# EAGLE design OMSI_TABLE12_v1 (EAGLE 9.6.1)
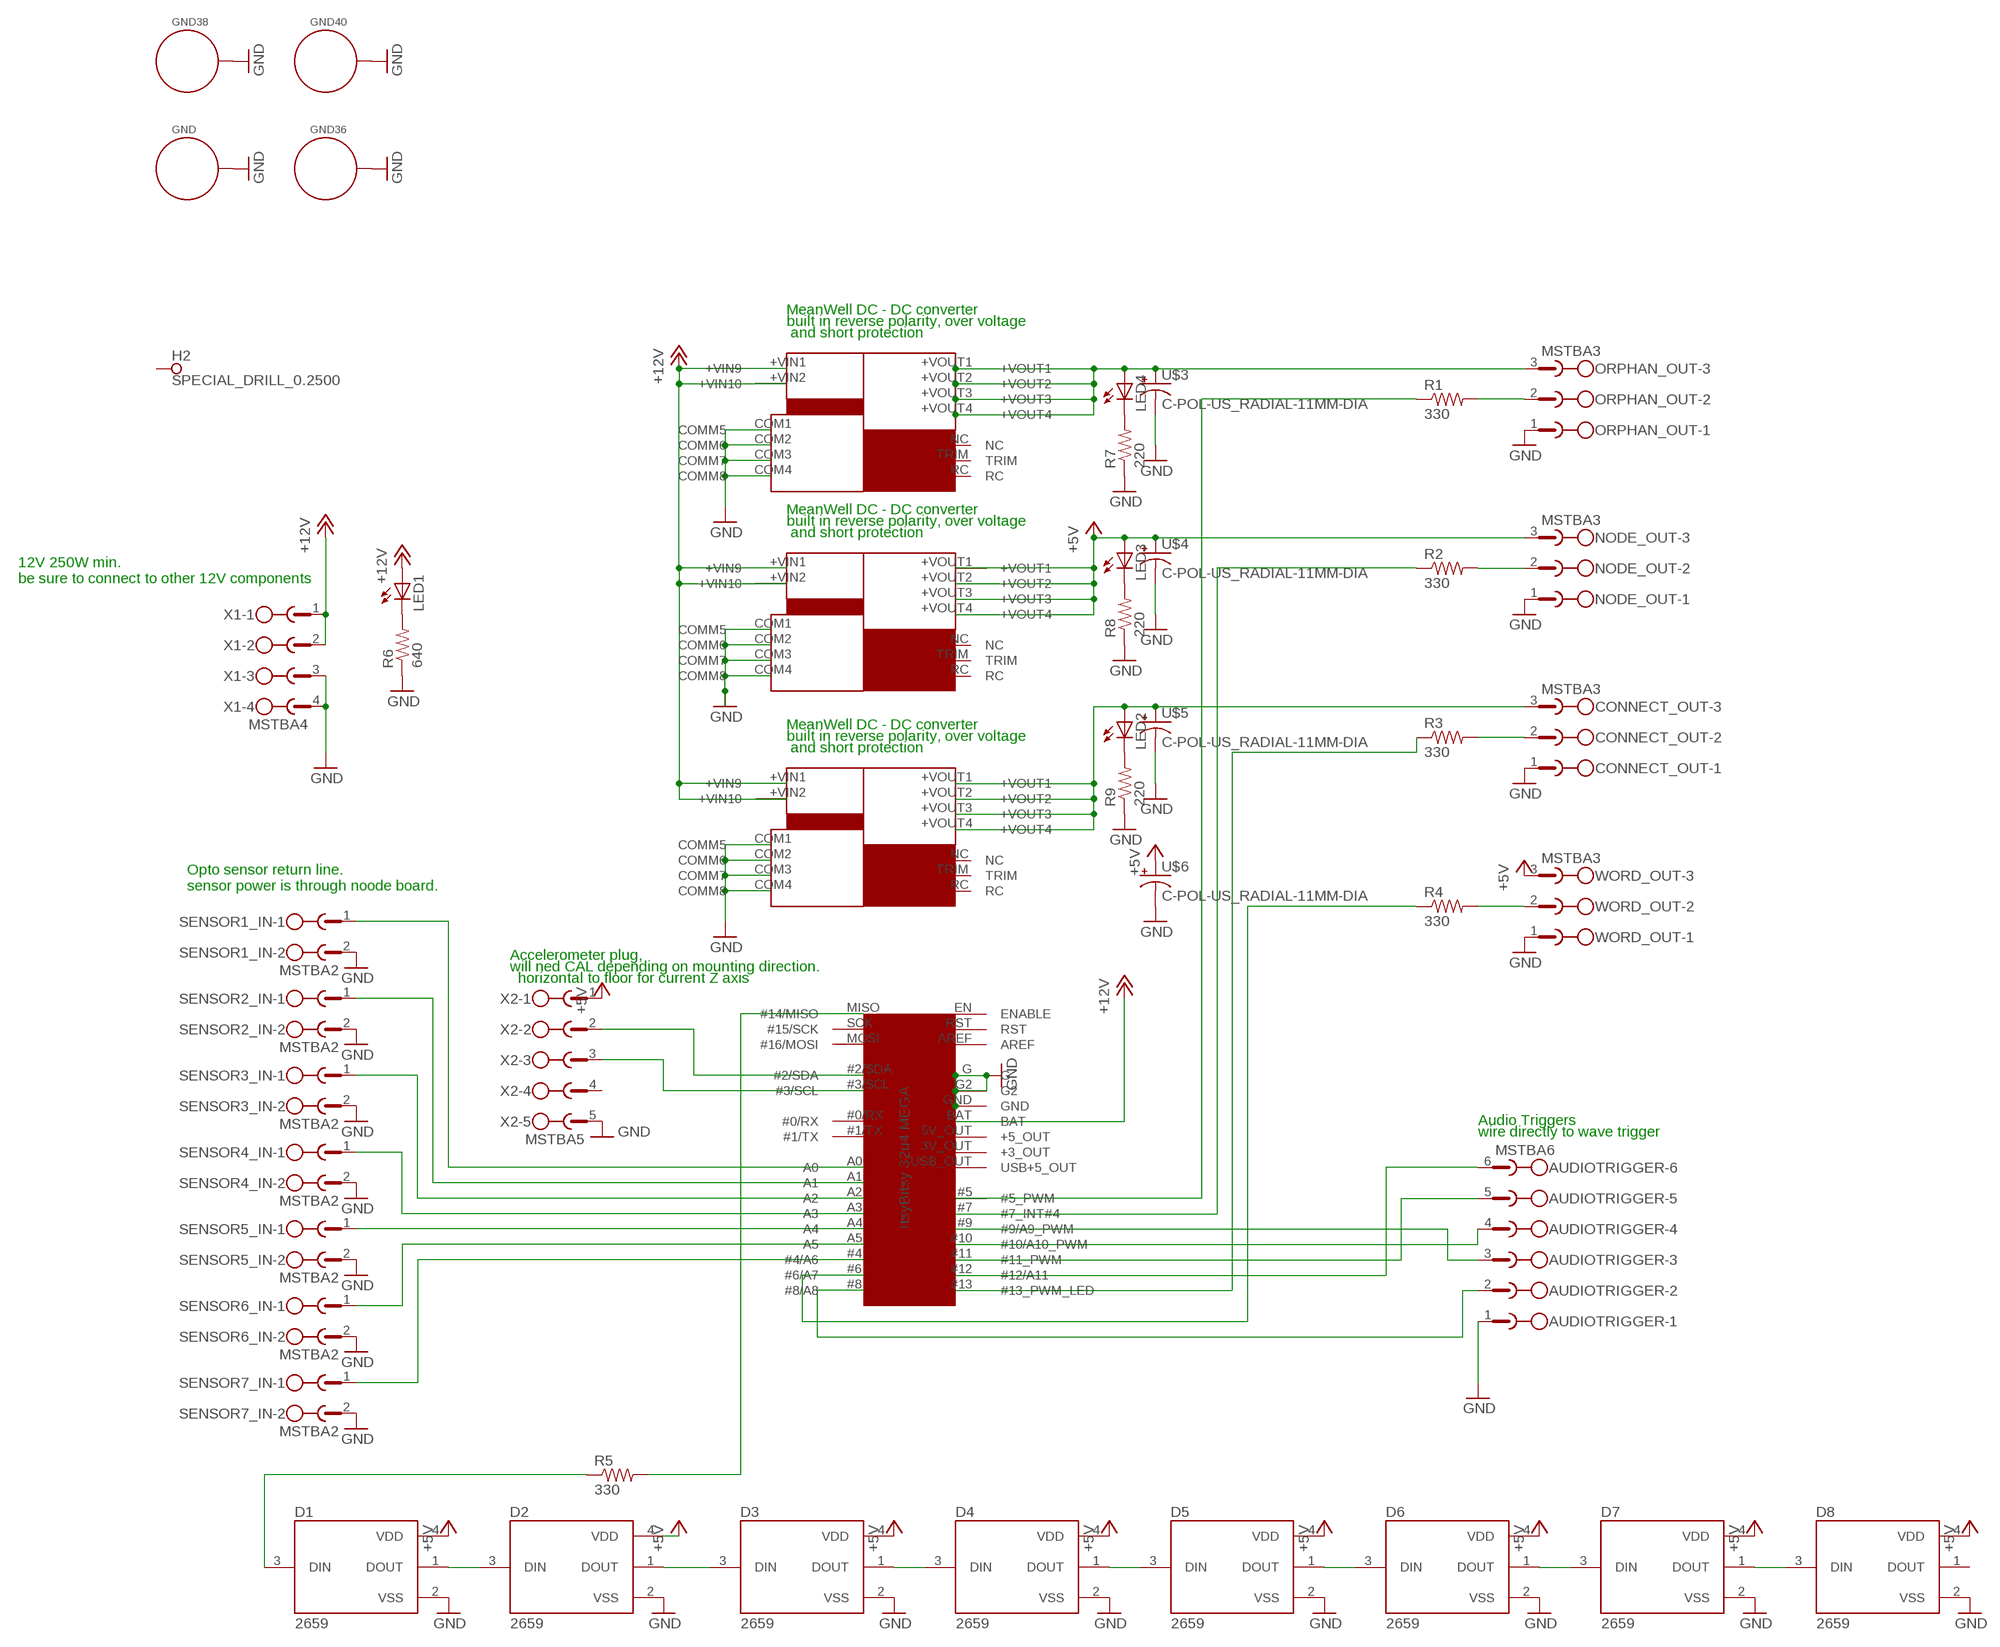
[diagram p0: schematic, sheet 1]

## Parts
AUDIOTRIGGER  MSTBA6  [MSTBA6]
CONNECT_OUT  MSTBA3  [MSTBA3]
D1  2659  [2659]
D2  2659  [2659]
D3  2659  [2659]
D4  2659  [2659]
D5  2659  [2659]
D6  2659  [2659]
D7  2659  [2659]
D8  2659  [2659]
GND  STANDOFF_ELECTRICAL5-32  [STANDOFF_ELECTRICAL_5_32]
GND36  STANDOFF_ELECTRICAL5-32  [STANDOFF_ELECTRICAL_5_32]
GND38  STANDOFF_ELECTRICAL5-32  [STANDOFF_ELECTRICAL_5_32]
GND40  STANDOFF_ELECTRICAL5-32  [STANDOFF_ELECTRICAL_5_32]
H2  SPECIAL_DRILL_0.2500  [PAD_0.2500]
LED1  LEDCHIPLED_1206  [CHIPLED_1206]
LED2  LEDCHIPLED_1206  [CHIPLED_1206]
LED3  LEDCHIPLED_1206  [CHIPLED_1206]
LED4  LEDCHIPLED_1206  [CHIPLED_1206]
MEANWELL_NID100_1  MEANWELL_NID100  [MEANWELL_NID100]
MEANWELL_NID100_2  MEANWELL_NID100  [MEANWELL_NID100]
MEANWELL_NID100_3  MEANWELL_NID100  [MEANWELL_NID100]
NODE_OUT  MSTBA3  [MSTBA3]
ORPHAN_OUT  MSTBA3  [MSTBA3]
R1  330  R-US_AXIAL-11.7MM-PITCH  [RESAD1176W63L850D250B]
R2  330  R-US_AXIAL-11.7MM-PITCH  [RESAD1176W63L850D250B]
R3  330  R-US_AXIAL-11.7MM-PITCH  [RESAD1176W63L850D250B]
R4  330  R-US_AXIAL-11.7MM-PITCH  [RESAD1176W63L850D250B]
R5  330  R-US_AXIAL-11.7MM-PITCH  [RESAD1176W63L850D250B]
R6  640  R-US_R0805  [R0805]
R7  220  R-US_R0805  [R0805]
R8  220  R-US_R0805  [R0805]
R9  220  R-US_R0805  [R0805]
SENSOR1_IN  MSTBA2  [MSTBA2]
SENSOR2_IN  MSTBA2  [MSTBA2]
SENSOR3_IN  MSTBA2  [MSTBA2]
SENSOR4_IN  MSTBA2  [MSTBA2]
SENSOR5_IN  MSTBA2  [MSTBA2]
SENSOR6_IN  MSTBA2  [MSTBA2]
SENSOR7_IN  MSTBA2  [MSTBA2]
U$1  ITSYBITSY_32U4  [ITSYBITSY_32U4]
U$3  C-POL-US_RADIAL-11MM-DIA  [CAPPRD508W65D1000H1100B]
U$4  C-POL-US_RADIAL-11MM-DIA  [CAPPRD508W65D1000H1100B]
U$5  C-POL-US_RADIAL-11MM-DIA  [CAPPRD508W65D1000H1100B]
U$6  C-POL-US_RADIAL-11MM-DIA  [CAPPRD508W65D1000H1100B]
WORD_OUT  MSTBA3  [MSTBA3]
X1  MSTBA4  [MSTBA4]
X2  MSTBA5  [MSTBA5]

## Nets
+5V: D1.4(VDD) D2.4(VDD) D3.4(VDD) D4.4(VDD) D5.4(VDD) D6.4(VDD) D7.4(VDD) D8.4(VDD) LED3.A MEANWELL_NID100_3.+VOUT1 MEANWELL_NID100_3.+VOUT2 MEANWELL_NID100_3.+VOUT3 MEANWELL_NID100_3.+VOUT4 NODE_OUT.3 U$4.1(+) U$6.1(+) WORD_OUT.3 X2.1
+12V: LED1.A MEANWELL_NID100_1.+VIN1(+VIN9) MEANWELL_NID100_1.+VIN2(+VIN10) MEANWELL_NID100_2.+VIN1(+VIN9) MEANWELL_NID100_2.+VIN2(+VIN10) MEANWELL_NID100_3.+VIN1(+VIN9) MEANWELL_NID100_3.+VIN2(+VIN10) U$1.BAT X1.1 X1.2
GND: AUDIOTRIGGER.1 CONNECT_OUT.1 D1.2(VSS) D2.2(VSS) D3.2(VSS) D4.2(VSS) D5.2(VSS) D6.2(VSS) D7.2(VSS) D8.2(VSS) GND36.P1 GND38.P1 GND40.P1 GND.P1 MEANWELL_NID100_1.COM1(COMM5) MEANWELL_NID100_1.COM2(COMM6) MEANWELL_NID100_1.COM3(COMM7) MEANWELL_NID100_1.COM4(COMM8) MEANWELL_NID100_2.COM1(COMM5) MEANWELL_NID100_2.COM2(COMM6) MEANWELL_NID100_2.COM3(COMM7) MEANWELL_NID100_2.COM4(COMM8) MEANWELL_NID100_3.COM1(COMM5) MEANWELL_NID100_3.COM2(COMM6) MEANWELL_NID100_3.COM3(COMM7) MEANWELL_NID100_3.COM4(COMM8) NODE_OUT.1 ORPHAN_OUT.1 R6.1 R7.1 R8.1 R9.1 SENSOR1_IN.2 SENSOR2_IN.2 SENSOR3_IN.2 SENSOR4_IN.2 SENSOR5_IN.2 SENSOR6_IN.2 SENSOR7_IN.2 U$1.G U$1.G2 U$1.GND U$3.2(-) U$4.2(-) U$5.2(-) U$6.2(-) WORD_OUT.1 X1.3 X1.4 X2.5
N$1: LED4.A MEANWELL_NID100_2.+VOUT1 MEANWELL_NID100_2.+VOUT2 MEANWELL_NID100_2.+VOUT3 MEANWELL_NID100_2.+VOUT4 ORPHAN_OUT.3 U$3.1(+)
N$2: U$1.#2/SDA X2.2
N$3: U$1.#3/SCL X2.3
N$4: SENSOR1_IN.1 U$1.A0
N$5: SENSOR2_IN.1 U$1.A1
N$6: SENSOR3_IN.1 U$1.A2
N$7: CONNECT_OUT.3 LED2.A MEANWELL_NID100_1.+VOUT1 MEANWELL_NID100_1.+VOUT2 MEANWELL_NID100_1.+VOUT3 MEANWELL_NID100_1.+VOUT4 U$5.1(+)
N$8: SENSOR4_IN.1 U$1.A3
N$9: ORPHAN_OUT.2 R1.2
N$10: R1.1 U$1.#5(#5_PWM)
N$11: NODE_OUT.2 R2.2
N$12: SENSOR5_IN.1 U$1.A4
N$13: SENSOR6_IN.1 U$1.A5
N$14: SENSOR7_IN.1 U$1.#4(#4/A6)
N$15: R2.1 U$1.#7(#7_INT#4)
N$16: CONNECT_OUT.2 R3.2
N$17: R3.1 U$1.#13(#13_PWM_LED)
N$18: R4.2 WORD_OUT.2
N$19: R4.1 U$1.#6(#6/A7)
N$20: AUDIOTRIGGER.6 U$1.#12(#12/A11)
N$21: AUDIOTRIGGER.5 U$1.#11(#11_PWM)
N$22: R5.2 U$1.MISO(#14/MISO)
N$23: AUDIOTRIGGER.4 U$1.#10(#10/A10_PWM)
N$24: AUDIOTRIGGER.3 U$1.#9(#9/A9_PWM)
N$25: AUDIOTRIGGER.2 U$1.#8(#8/A8)
N$26: D1.1(DOUT) D2.3(DIN)
N$27: D2.1(DOUT) D3.3(DIN)
N$28: D3.1(DOUT) D4.3(DIN)
N$29: D4.1(DOUT) D5.3(DIN)
N$30: D5.1(DOUT) D6.3(DIN)
N$31: D6.1(DOUT) D7.3(DIN)
N$32: D7.1(DOUT) D8.3(DIN)
N$33: D1.3(DIN) R5.1
N$34: LED1.C R6.2
N$35: LED4.C R7.2
N$36: LED3.C R8.2
N$37: LED2.C R9.2
Unconnected: D8.1(DOUT) H2.1 MEANWELL_NID100_1.NC MEANWELL_NID100_1.RC MEANWELL_NID100_1.TRIM MEANWELL_NID100_2.NC MEANWELL_NID100_2.RC MEANWELL_NID100_2.TRIM MEANWELL_NID100_3.NC MEANWELL_NID100_3.RC MEANWELL_NID100_3.TRIM U$1.#0/RX U$1.#1/TX U$1.EN(ENABLE) U$1.MOSI(#16/MOSI) U$1.SCK(#15/SCK) X2.4

## Notes on the sheet
- MeanWell DC - DC converter
  built in reverse polarity, over voltage
   and short protection
- MeanWell DC - DC converter
  built in reverse polarity, over voltage
   and short protection
- 12V 250W min.
  be sure to connect to other 12V components
- MeanWell DC - DC converter
  built in reverse polarity, over voltage
   and short protection
- Opto sensor return line.
  sensor power is through noode board.
- Accelerometer plug, 
  will ned CAL depending on mounting direction.
    horizontal to floor for current Z axis
- Audio Triggers
  wire directly to wave trigger

## Power pins joined to a net without a drawn wire
+3_OUT: U$1.3V_OUT(+3_OUT)
+5_OUT: U$1.5V_OUT(+5_OUT)
AREF: U$1.AREF
RST: U$1.RST
USB+5_OUT: U$1.USB_OUT(USB+5_OUT)

## Library data of the parts
AUDIOTRIGGER = con-phoenix-508:MSTBA6: PHOENIX; MF: FARNELL; MPN: 1757284; OC_FARNELL: 3705213; OC_NEWARK: 71C4165
CONNECT_OUT NODE_OUT ORPHAN_OUT WORD_OUT = con-phoenix-508:MSTBA3: PHOENIX; MF: FARNELL; MPN: 1757255; OC_FARNELL: 3705183; OC_NEWARK: 71C4162
D1-D8 = 2659:2659: NeoPixel Mini 3535 RGB LEDs w/ Integrated Driver Chip - White; DESCRIPTION: 20 AWG Hook-Up Wire 26/34 White 300V 40.00' _12.19m_; MF: Adafruit Industries; MP: 2659; PACKAGE: TQFP-32 Adafruit Industries
GND GND36 GND38 GND40 = th_libraries:STANDOFF_ELECTRICAL: A standoff intended to be an electrically connected point. Pad size and stop size allow for a #8 Phillips pan screw head to make a solid connection to the board. Added 144mill drill hole that fits my normal wood screw
H2 = special-drill:SPECIAL_DRILL_: Special drills
LED1-LED4 = adafruit:LED: LED OSRAM: - CHIPLED LG R971, LG N971, LY N971, LG Q971, LY Q971, LO R971, LY R971 LH N974, LH R974 LS Q976, LO Q976, LY Q976 LO Q996 - Hyper CHIPLED LW Q18S LB Q993, LB Q99A, LB R99A - SideLED LS A670, LO A670, LY A670, LG A670, LP A670 LB A673, LV A673, LT A673, LW A673 LH A674 LY A675 LS A676, LA A676, LO A676, LY A676, LW A676 LS A679, LY A679, LG A679 - Hyper Micro SIDELED® LS Y876, LA Y876, LO Y876, LY Y876 LT Y87S - SmartLED LW L88C, LW L88S LB L89C, LB L89S, LG L890 LS L89K, LO L89K, LY L89K LS L896, LA L896, LO L896, LY L896 - TOPLED LS T670, LO T670, LY T670, LG T670, LP T670 LSG T670, LSP T670, LSY T670, LOP T670, LYG T670 LG T671, LOG T671, LSG T671 LB T673, LV T673, LT T673, LW T673 LH T674 LS T676, LA T676, LO T676, LY T676, LB T676, LH T676, LSB T676, LW T676 LB T67C, LV T67C, LT T67C, LS T67K, LO T67K, LY T67K, LW E67C LS E67B, LA E67B, LO E67B, LY E67B, LB E67C, LV E67C, LT E67C LW T67C LS T679, LY T679, LG T679 LS T770, LO T770, LY T770, LG T770, LP T770 LB T773, LV T773, LT T773, LW T773 LH T774 LS E675, LA E675, LY E675, LS T675 LS T776, LA T776, LO T776, LY T776, LB T776 LHGB T686 LT T68C, LB T68C - Hyper Mini TOPLED® LB M676 - Mini TOPLED Santana® LG M470 LS M47K, LO M47K, LY M47K Source: http://www.osram.convergy.de/
MEANWELL_NID100_1-MEANWELL_NID100_3 = _Library_test.fef566de-641b-440a-8c62-be1921989066.flbr:MEANWELL_NID100
R1-R5 = Resistor:R-US: Resistor Fixed - ANSI; CATEGORY: Resistor; SUB-CATEGORY: Fixed
R6-R9 = adafruit:R-US_: RESISTOR, American symbol
SENSOR1_IN SENSOR2_IN SENSOR3_IN SENSOR4_IN SENSOR5_IN SENSOR6_IN SENSOR7_IN = con-phoenix-508:MSTBA2: PHOENIX; MF: FARNELL; MPN: 1757242; OC_FARNELL: 3705171; OC_NEWARK: 71C4161
U$1 = _Library_test.fef566de-641b-440a-8c62-be1921989066.flbr:ITSYBITSY_32U4
U$3-U$6 = Capacitor:C-POL-US: Capacitor Polarised - ANSI; CATEGORY: Capacitor
X1 = con-phoenix-508:MSTBA4: PHOENIX; MF: FARNELL; MPN: 1757268; OC_FARNELL: 3705195; OC_NEWARK: 71C4163
X2 = con-phoenix-508:MSTBA5: PHOENIX; MPN: 1757271; OC_FARNELL: 3705201; OC_NEWARK: 71C4164

## Board
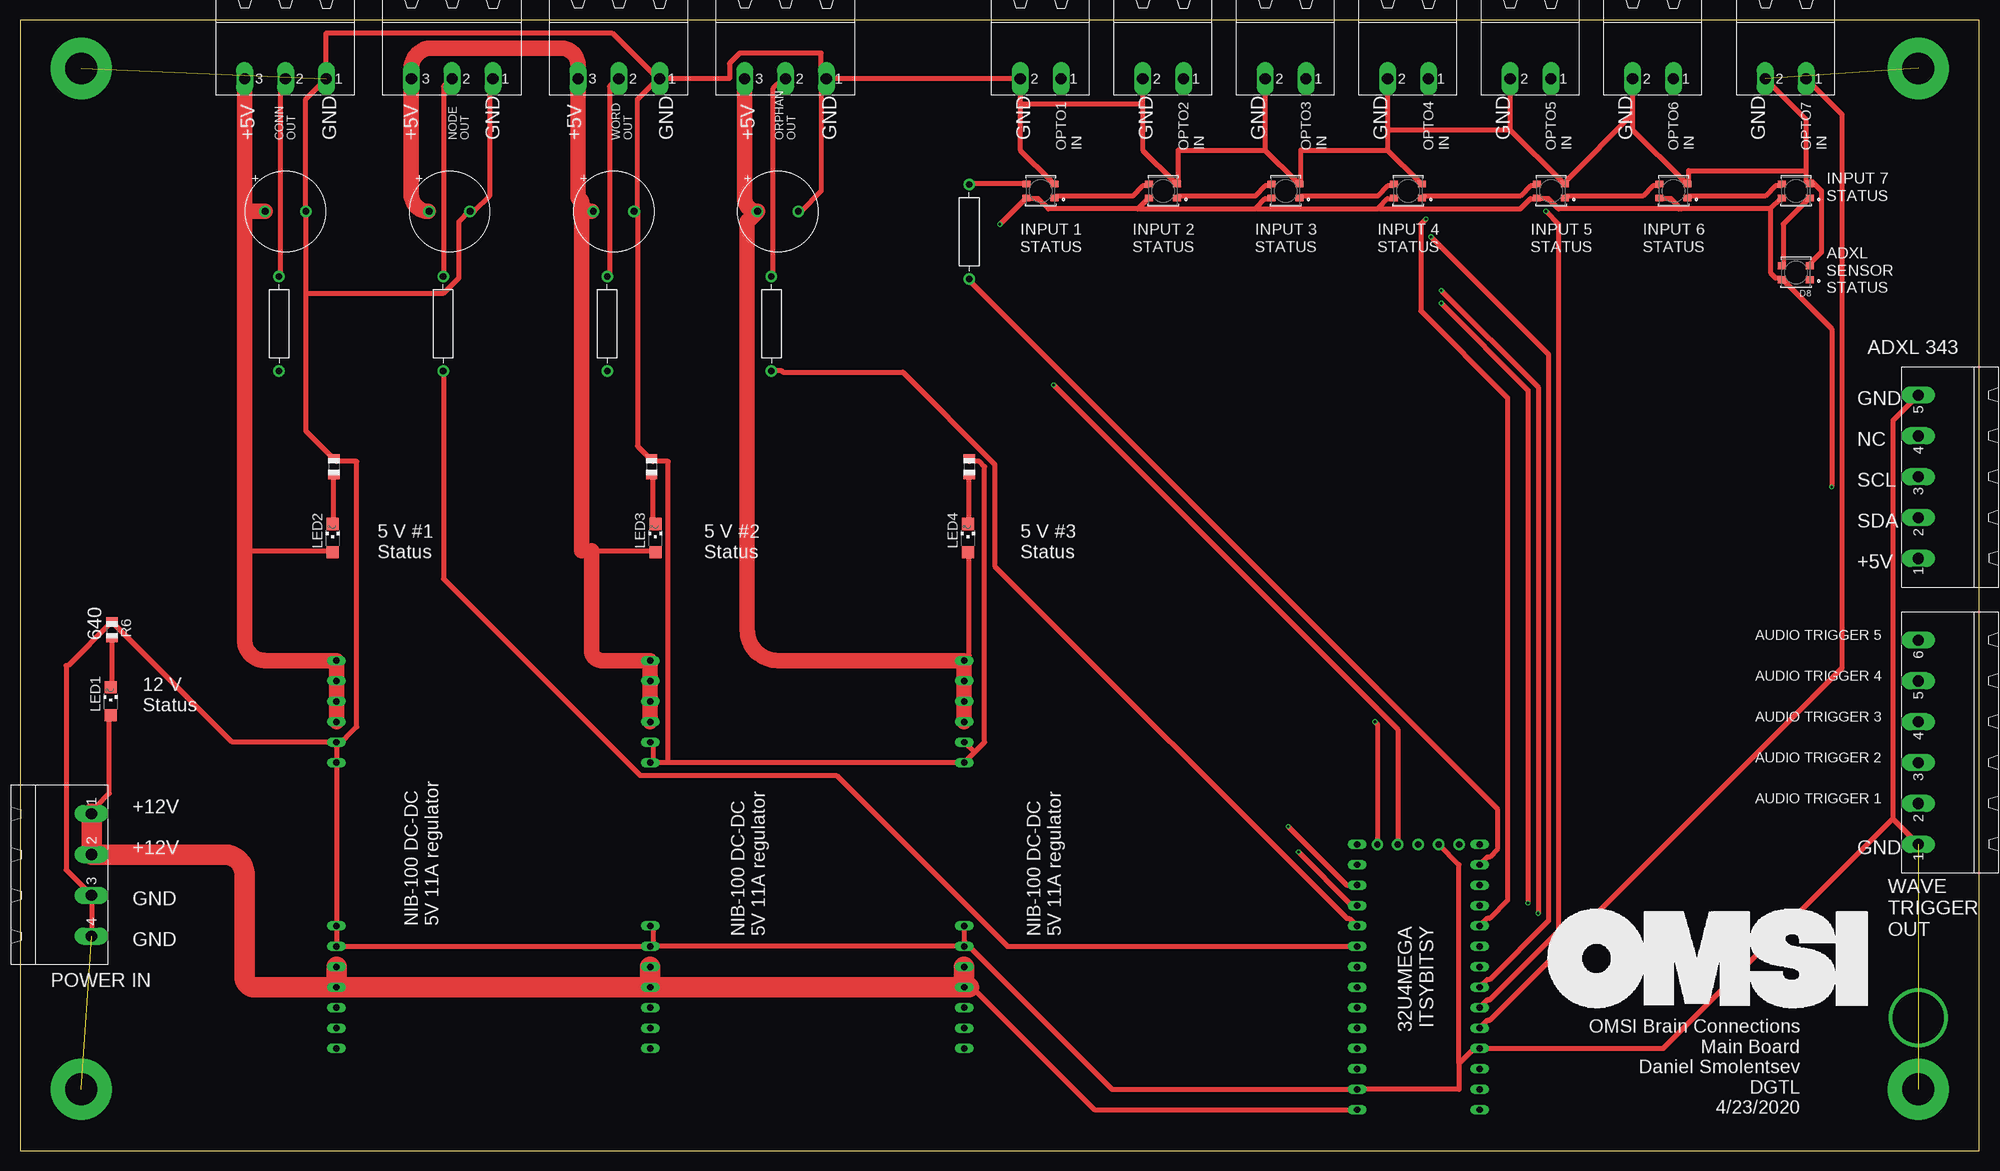
[diagram p1: board, top side]
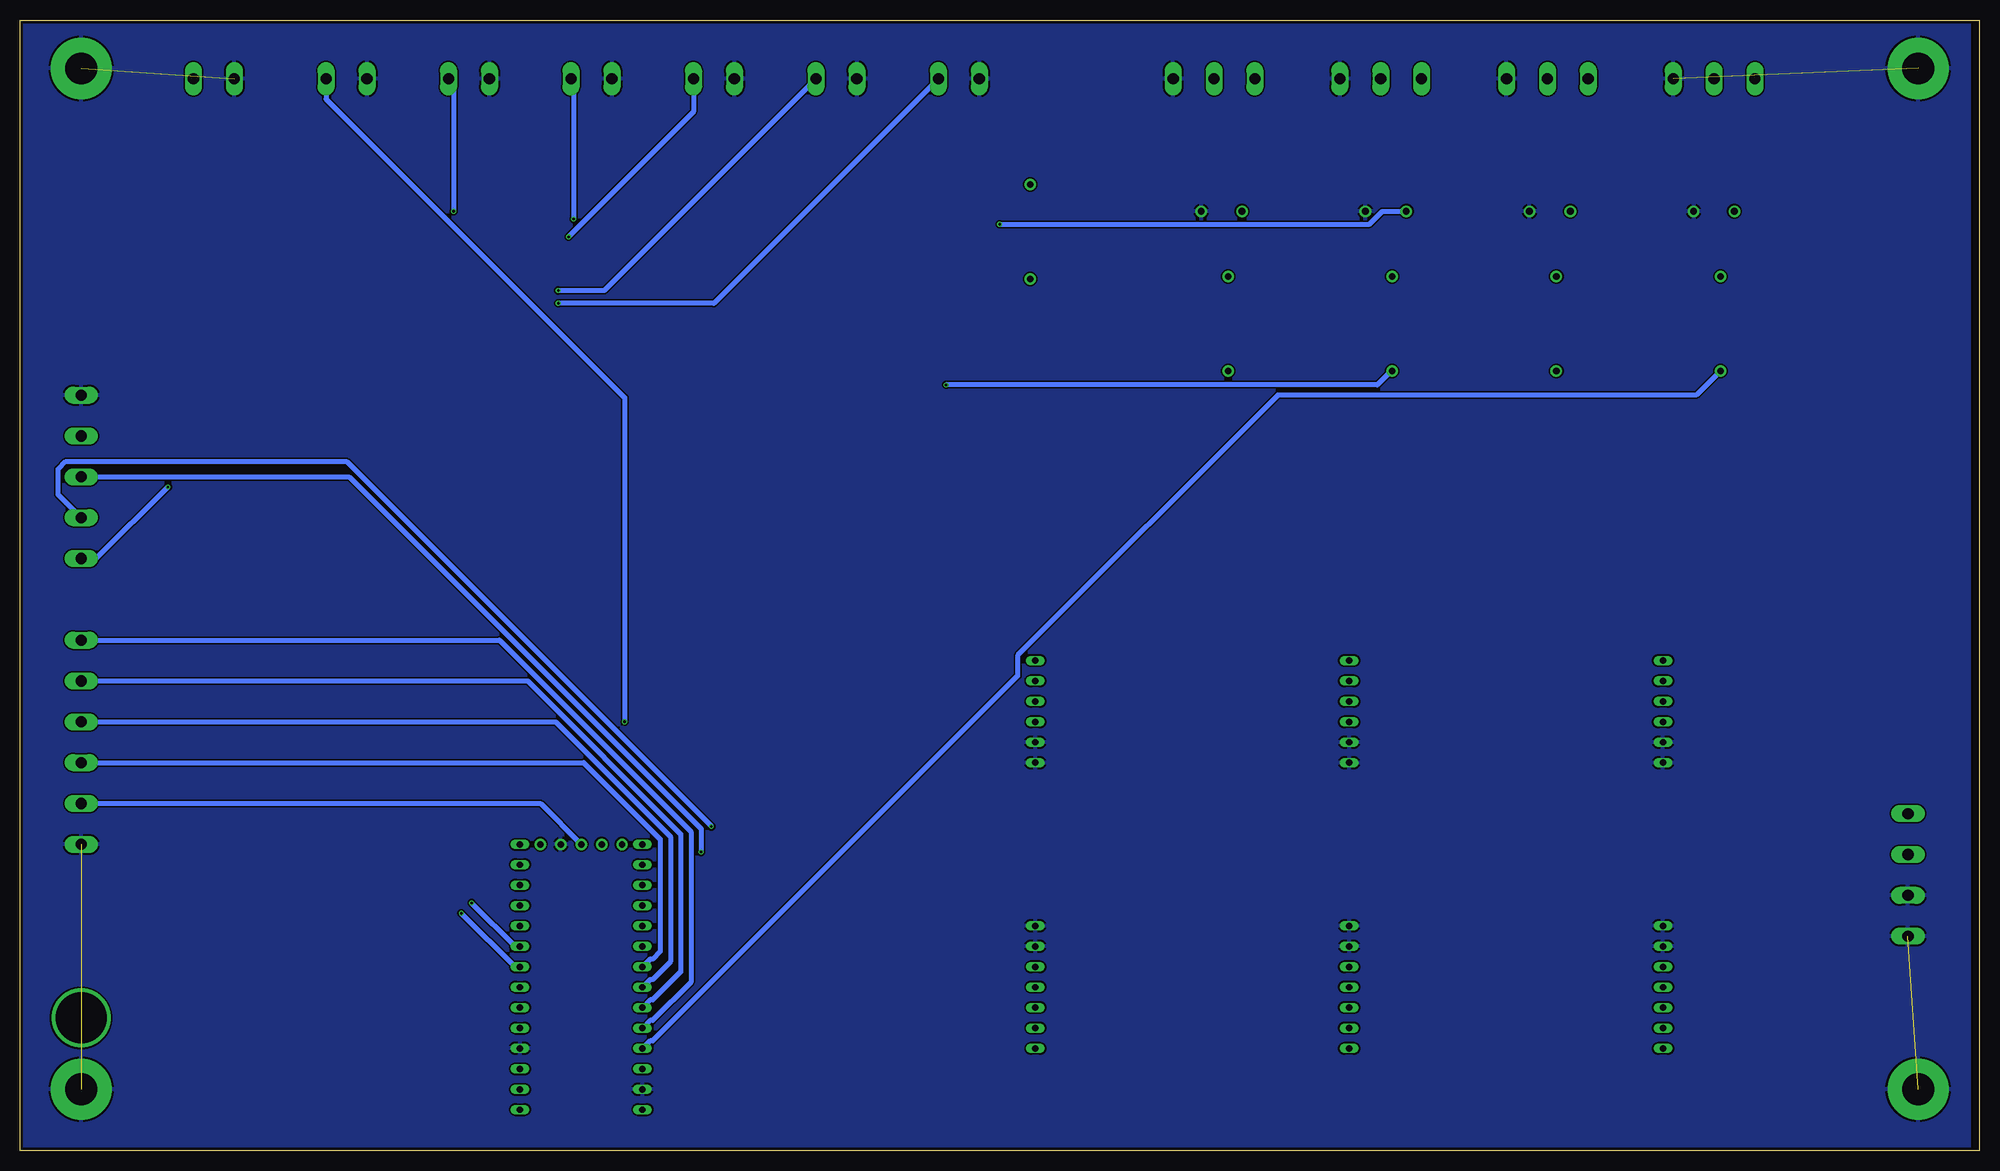
[diagram p2: board, bottom side, seen from below]

Size 243.82 x 140.64 mm. Coordinates in mm from the lower left corner, seen from the top.
Outline: 0,0 243.82,0 243.82,140.64 0,140.64 0,0
Copper layers (1*16): Top 0.035559375mm / dielectric 1.6mm / Bottom 0.035559375mm
Design rules "oshpark-2layer_8mil": minimum track width 8mil, minimum drill 10mil, track to track 8mil, track to pad 8mil, pad to pad 8mil, via to via 8mil, smd to smd 8mil, copper to edge 15mil, drill to drill 8mil, minimum pad ring 5mil, minimum via ring 5mil, stop-mask expansion 2.5mil, vias tented up to drill 0mil, thermal gap 10mil

### Footprints (pad centres in the part's own frame; a part is rotated, then mirrored left to right if it is on the bottom)
MSTBA6 = drill 1.397 long: 1 -12.7,5.08; 2 -7.62,5.08; 3 -2.54,5.08; 4 2.54,5.08; 5 7.62,5.08; 6 12.7,5.08
MSTBA3 = drill 1.397 long: 1 -5.08,5.08; 2 0,5.08; 3 5.08,5.08
2659 = smd 1 x 0.85: 1 -1.75,0.875; 2 -1.75,-0.875; 3 1.75,-0.875; 4 1.75,0.875
STANDOFF_ELECTRICAL_5_32 = drill 3.969 pad 7.62: P1 0,0
PAD_0.2500 = drill 6.35 pad 6.35: 1 0,0
CHIPLED_1206 = smd 1.5 x 1.5: A 0,-1.75; C 0,1.75
MEANWELL_NID100 = drill 0.8 long: +VIN1 0,-20.32; +VIN2 0,-22.86; +VOUT1 0,17.78; +VOUT2 0,15.24; +VOUT3 0,12.7; +VOUT4 0,10.16; COM1 0,7.62; COM2 0,5.08; COM3 0,-15.24; COM4 0,-17.78; NC 0,-25.4; RC 0,-30.48; TRIM 0,-27.94
RESAD1176W63L850D250B = drill 0.83 pad 1.43: 1 -5.88,0; 2 5.88,0
R0805 = smd 1.1 x 1.4: 1 -1,0; 2 1,0
MSTBA2 = drill 1.397 long: 1 -2.54,5.08; 2 2.54,5.08
ITSYBITSY_32U4 = drill 0.8 long: 3V_OUT -7.62,-17.78; 5V_OUT -7.62,12.7; #0/RX 7.62,-17.78; #1/TX 7.62,-15.24; #2/SDA 7.62,-12.7; #3/SCL 7.62,-10.16; #5 7.62,-7.62; #7 7.62,-5.08; #9 7.62,-2.54; #10 7.62,0; #11 7.62,2.54; #12 7.62,5.08; #13 7.62,7.62; A0 -7.62,5.08; A1 -7.62,2.54; A2 -7.62,0; A3 -7.62,-2.54; A4 -7.62,-5.08; A5 -7.62,-7.62; AREF -7.62,10.16; BAT 7.62,15.24; G2 7.62,12.7; GND -7.62,7.62; MISO -7.62,-15.24; MOSI -7.62,-12.7; RST -7.62,15.24; SCK -7.62,-10.16; USB_OUT 7.62,10.16 | drill 0.8 pad 1.422: #4 5.08,-17.78; #6 2.54,-17.78; #8 0,-17.78; EN -5.08,-17.78; G -2.54,-17.78
CAPPRD508W65D1000H1100B = drill 0.85 pad 1.45: 1 -2.54,0; 2 2.54,0
MSTBA4 = drill 1.397 long: 1 -7.62,5.08; 2 -2.54,5.08; 3 2.54,5.08; 4 7.62,5.08
MSTBA5 = drill 1.397 long: 1 -10.16,5.08; 2 -5.08,5.08; 3 0,5.08; 4 5.08,5.08; 5 10.16,5.08

### Placement (x,y rotation side)
AUDIOTRIGGER  241.3,50.8 90 top
CONNECT_OUT  33.02,138.43 180 top
D1  127,119.38 180 top
D2  142.24,119.38 180 top
D3  157.48,119.38 180 top
D4  172.72,119.38 180 top
D5  190.5,119.38 180 top
D6  205.74,119.38 180 top
D7  220.98,119.38 180 top
D8  220.98,109.22 180 top
GND  7.62,7.62 0 top
GND36  236.22,7.62 0 top
GND38  7.62,134.62 0 top
GND40  236.22,134.62 0 top
H2  236.22,16.51 0 top
LED1  11.27,55.88 0 top
LED2  38.89,76.2 0 top
LED3  79.06,76.2 0 top
LED4  117.95,76.2 0 top
MEANWELL_NID100_1  39.37,43.18 0 top
MEANWELL_NID100_2  117.48,43.18 0 top
MEANWELL_NID100_3  78.42,43.18 0 top
NODE_OUT  53.76,138.43 180 top
ORPHAN_OUT  95.25,138.43 180 top
R1  93.5,102.87 90 top
R2  52.65,102.87 90 top
R3  32.23,102.87 90 top
R4  73.07,102.87 90 top
R5  118.11,114.3 270 top
R6  11.43,64.77 270 top
R7  118.11,85.09 270 top
R8  78.58,85.09 270 top
R9  39.05,85.09 270 top
SENSOR1_IN  219.71,138.43 180 top
SENSOR2_IN  187.96,138.43 180 top
SENSOR3_IN  157.48,138.43 180 top
SENSOR4_IN  142.24,138.43 180 top
SENSOR5_IN  127,138.43 180 top
SENSOR6_IN  172.72,138.43 180 top
SENSOR7_IN  203.2,138.43 180 top
U$1  173.99,20.32 180 top
U$3  94.29,116.84 0 top
U$4  73.87,116.84 0 top
U$5  33.02,116.84 0 top
U$6  53.44,116.84 0 top
WORD_OUT  74.51,138.43 180 top
X1  3.81,34.29 270 top
X2  241.3,83.82 90 top

### Tracks (layer width: path | path; a pad name or v marks a point on that pad's centre or on a via)
+5V  (via drill 0.35)
  Top 0.61: 69.85,74.61 71.12,74.61 78.74,74.61 LED3.A | U$6.1 50.8,116.84 | U$4.1 71.12,116.84 | 139.22,117.32 139.06,117.16 127.95,117.16 126.68,118.43 125.41,118.43 D1.4 125.09,118.43 v121.92,115.25 | 153.83,117.32 153.67,117.16 139.38,117.16 139.22,117.32 | 153.83,117.32 154.94,118.43 155.58,118.43 D3.4 | 169.07,117.32 168.91,117.16 153.99,117.16 153.83,117.32 | 169.07,117.32 170.18,118.43 170.81,118.43 D4.4 | 169.07,117.32 169.23,117.16 186.69,117.16 187.96,118.43 188.59,118.43 D5.4 188.91,118.43 190.18,118.43 191.45,117.16 206.38,117.16 206.53,117.32 | 217.81,117.16 217.81,109.22 218.44,108.58 219.08,108.58 D8.4 219.39,108.27 225.43,102.23 v225.43,82.55 | 217.81,117.16 219.08,118.43 D7.4 | 206.53,117.32 206.69,117.16 217.81,117.16 | 206.53,117.32 205.42,118.43 204.15,118.43 D6.4 | 139.22,117.32 140.41,118.5 D2.4
  Top 1.905: 50.8,116.84 arc-90 48.68,118.96 NODE_OUT.3 48.68,134.62 arc-90 51.22,137.16 67.31,137.16 arc-90 69.43,135.04 WORD_OUT.3 69.43,118.53 69.85,118.11 | 69.85,118.11 arc90 71.12,116.84 | 69.85,118.11 69.85,74.61 | 71.12,74.61 71.12,62.23 arc90 72.39,60.96 MEANWELL_NID100_3.+VOUT1 MEANWELL_NID100_3.+VOUT2 MEANWELL_NID100_3.+VOUT3 MEANWELL_NID100_3.+VOUT4
  Bottom 0.61: X2.1 234.31,73.66 v225.43,82.55 | U$4.1 74.3,116.84 75.88,115.25 v121.92,115.25
+12V
  Top 0.61: LED1.A 11.11,53.98 11.11,44.45 9.53,42.86 X1.1 | U$1.BAT 133.67,5.08 119.06,19.69 118.11,20.32
  Top 2.54: X1.1 X1.2 25.4,36.83 arc-90 27.94,34.29 27.94,21.59 arc90 29.21,20.32 MEANWELL_NID100_1.+VIN2 | MEANWELL_NID100_1.+VIN1 MEANWELL_NID100_1.+VIN2 | MEANWELL_NID100_3.+VIN2 MEANWELL_NID100_1.+VIN2 | MEANWELL_NID100_2.+VIN2 118.11,20.32 | MEANWELL_NID100_2.+VIN2 MEANWELL_NID100_2.+VIN1 | MEANWELL_NID100_2.+VIN2 MEANWELL_NID100_3.+VIN2 | MEANWELL_NID100_3.+VIN1 MEANWELL_NID100_3.+VIN2
GND  (4 unrouted)
  Top 0.61: 76.84,116.84 76.84,87.63 78.11,86.36 R8.1 78.74,85.72 80.65,85.72 80.65,48.26 | 79.38,133.35 76.84,130.81 76.84,116.84 | 76.84,116.84 U$4.2 | 78.74,48.26 78.74,50.8 MEANWELL_NID100_3.COM1 | 118.75,49.53 MEANWELL_NID100_2.COM2 80.65,48.26 | 118.75,49.53 120.02,50.8 120.02,85.09 119.38,85.72 118.11,85.72 R7.1 | 118.75,49.53 MEANWELL_NID100_2.COM1 | 80.65,48.26 78.74,48.26 | 78.74,48.26 MEANWELL_NID100_3.COM2 | D8.2 222.88,110.49 224.16,111.76 224.16,119.38 222.88,120.65 D7.2 222.25,120.65 222.25,121.92 | SENSOR1_IN.2 222.25,128.27 222.25,121.92 | 185.42,127 191.77,120.65 D5.2 192.41,120.65 200.66,128.91 | SENSOR2_IN.2 185.42,127 | SENSOR7_IN.2 200.66,128.91 | 200.66,128.91 200.66,127 207.01,120.65 D6.2 207.65,120.65 207.65,121.92 222.25,121.92 | 99.7,133.35 99.7,119.38 97.16,116.84 U$3.2 | 170.18,124.46 173.99,120.65 D4.2 | SENSOR6_IN.2 170.18,127 | 170.18,127 170.18,124.46 | 154.94,124.46 158.75,120.65 D3.2 159.38,120.65 159.38,124.46 170.18,124.46 | SENSOR3_IN.2 154.94,124.46 | 124.46,130.18 SENSOR5_IN.2 ORPHAN_OUT.1 99.7,133.35 | 124.46,130.18 124.46,124.46 128.27,120.65 D1.2 | SENSOR4_IN.2 139.7,130.18 | 139.7,130.18 139.7,124.46 143.51,120.65 D2.2 144.15,120.65 144.15,124.46 154.94,124.46 | 139.7,130.18 124.46,130.18 | 170.18,127 185.42,127 | 99.7,133.35 99.7,136.53 89.54,136.53 88.27,135.25 88.27,133.35 WORD_OUT.1 79.38,133.35 | NODE_OUT.1 58.42,133.35 58.42,118.74 56.52,116.84 U$6.2 55.88,116.84 54.61,115.57 54.61,108.58 52.7,106.68 35.56,106.68 | 35.56,106.68 U$5.2 35.56,130.81 CONNECT_OUT.1 38.1,139.06 73.66,139.06 79.38,133.35 | 35.56,106.68 35.56,89.53 38.73,86.36 R9.1 39.37,85.72 41.91,85.72 41.91,52.7 39.37,50.16
  Top 0.61: 233.05,41.27 AUDIOTRIGGER.1 | 233.05,41.27 233.05,90.8 X2.5 | 179.07,10.8 179.07,7.62 U$1.G2 135.89,7.62 117.48,26.04 | 179.07,10.8 180.97,12.7 U$1.GND 204.47,12.7 233.05,41.27 | U$1.G 179.07,35.56 179.07,10.8 | 78.74,25.4 78.74,27.94 MEANWELL_NID100_3.COM3 | MEANWELL_NID100_2.COM3 117.48,26.04 | 78.74,25.4 MEANWELL_NID100_2.COM4 117.48,26.04 | 78.74,25.4 MEANWELL_NID100_3.COM4 MEANWELL_NID100_1.COM4 MEANWELL_NID100_1.COM3 MEANWELL_NID100_1.COM2 39.37,50.16 | X1.4 X1.3 5.71,34.93 5.71,60.33 5.99,60.33 R6.1 26.4,50.8 MEANWELL_NID100_1.COM1 39.37,50.16
  pour Bottom: 1.27,0 1.27,140.97 243.84,140.97 243.84,0
N$1
  Top 0.61: LED4.A 118.11,74.29 118.11,61.6 MEANWELL_NID100_2.+VOUT1
  Top 1.905: ORPHAN_OUT.3 90.17,118.42 arc90 U$3.1 90.48,115.57 90.48,64.77 arc90 94.29,60.96 MEANWELL_NID100_2.+VOUT1 MEANWELL_NID100_2.+VOUT2 MEANWELL_NID100_2.+VOUT3 MEANWELL_NID100_2.+VOUT4
N$2  (via drill 0.35)
  Top 0.61: U$1.#2/SDA 165.1,33.02 v157.8,40.32
  Bottom 0.61: v157.8,40.32 203.2,85.72 238.12,85.72 239.08,84.77 239.08,81.6 X2.2
N$3  (via drill 0.35)
  Top 0.61: U$1.#3/SCL 165.74,30.48 v159.07,37.15
  Bottom 0.61: v159.07,37.15 159.07,40.01 202.88,83.82 X2.3
N$4
  Top 0.61: U$1.A0 182.56,16.19 182.88,16.19 226.69,60.01 226.69,128.91 SENSOR1_IN.1
N$5  (via drill 0.35)
  Top 0.61: U$1.A1 182.56,18.73 182.88,18.73 191.45,27.3 191.45,115.25 v189.87,116.84
  Bottom 0.61: v189.87,116.84 189.87,132.72 SENSOR2_IN.1
N$6  (via drill 0.35)
  Top 0.61: U$1.A2 182.56,21.27 182.88,21.27 190.18,28.57 190.18,99.06 v175.58,113.66
  Bottom 0.61: v175.58,113.66 160.02,129.22 SENSOR3_IN.1
N$7
  Top 0.61: 27.94,74.61 38.73,74.61 LED2.A
  Top 1.905: CONNECT_OUT.3 27.94,116.84 | 27.94,116.84 U$5.1 | 27.94,116.84 27.94,74.61 27.94,63.5 arc90 30.48,60.96 MEANWELL_NID100_1.+VOUT1 MEANWELL_NID100_1.+VOUT2 MEANWELL_NID100_1.+VOUT3 MEANWELL_NID100_1.+VOUT4
N$8  (via drill 0.35)
  Top 0.61: v188.91,29.53 188.91,94.93 v176.85,107
  Bottom 0.61: U$1.A3 182.25,22.86 v188.91,29.53 | v176.85,107 171.13,107 SENSOR4_IN.1
N$9
  Top 0.61: R1.2 93.66,108.9 93.66,132.08 94.93,133.35 ORPHAN_OUT.2
N$10
  Top 0.61: U$1.#5 165.42,28.89 165.1,28.89 121.29,72.71 121.29,85.41 109.86,96.84 94.93,96.84 94.77,96.99 R1.1
N$11
  Top 0.61: R2.2 52.7,108.9 52.7,132.4 53.66,133.35 NODE_OUT.2
N$12  (via drill 0.35)
  Top 0.61: v187.64,30.8 187.64,94.61 v176.85,105.41
  Bottom 0.61: U$1.A4 182.25,25.4 v187.64,30.8 | v176.85,105.41 157.48,105.41 SENSOR5_IN.1
N$13  (via drill 0.35)
  Top 0.61: U$1.A5 182.56,28.89 182.88,28.89 185.1,31.12 185.1,93.66 174.31,104.46 174.31,115.25 v174.94,115.89
  Bottom 0.61: v174.94,115.89 174.94,133.03 SENSOR6_IN.1
N$14  (via drill 0.35)
  Top 0.61: U$1.#4 168.91,53.02 v168.59,53.34
  Bottom 0.61: v168.59,53.34 168.59,93.66 205.74,130.81 SENSOR7_IN.1
N$15
  Top 0.61: U$1.#7 122.87,25.4 101.6,46.67 77.15,46.67 52.7,71.12 52.7,96.84 R2.1
N$16
  Top 0.61: CONNECT_OUT.2 32.38,132.72 32.38,108.9 R3.2
N$17
  Bottom 0.61: U$1.#13 165.42,13.65 165.1,13.65 119.7,59.05 119.7,61.6 87.31,93.98 35.24,93.98 32.38,96.84 R3.1
N$18
  Top 0.61: R4.2 73.34,108.9 73.34,132.4 74.3,133.35 WORD_OUT.2
N$19  (via drill 0.35)
  Top 0.61: U$1.#6 171.45,52.39 v128.59,95.25
  Bottom 0.61: v128.59,95.25 74.93,95.25 73.34,96.84 R4.1
N$20
  Bottom 0.61: U$1.#12 165.42,16.19 165.1,16.19 160.34,20.96 160.34,39.69 184.15,63.5 AUDIOTRIGGER.6
N$21
  Bottom 0.61: U$1.#11 165.42,18.73 165.1,18.73 161.61,22.23 161.61,39.37 180.66,58.42 AUDIOTRIGGER.5
N$22
  Top 0.61: U$1.MISO 182.56,36.51 182.88,36.51 183.83,37.47 183.83,42.55 118.11,108.27 R5.2
N$23
  Bottom 0.61: U$1.#10 165.42,21.27 165.1,21.27 162.88,23.5 162.88,39.05 177.16,53.34 AUDIOTRIGGER.4
N$24
  Bottom 0.61: U$1.#9 165.42,23.81 165.1,23.81 164.15,24.77 164.15,38.73 173.67,48.26 AUDIOTRIGGER.3
N$25
  Bottom 0.61: U$1.#8 179.07,43.18 AUDIOTRIGGER.2
N$26
  Top 0.61: D1.1 128.91,118.74 138.43,118.74 139.7,120.02 140.34,120.02 D2.3
N$27
  Top 0.61: D2.1 144.15,118.74 153.67,118.74 154.94,120.02 155.58,120.02 D3.3
N$28
  Top 0.61: D3.1 159.38,118.74 168.91,118.74 170.18,120.02 170.81,120.02 D4.3
N$29
  Top 0.61: D4.1 174.62,118.74 186.69,118.74 187.96,120.02 188.59,120.02 D5.3
N$30
  Top 0.61: D5.1 192.41,118.74 201.93,118.74 203.2,120.02 203.84,120.02 D6.3
N$31
  Top 0.61: D6.1 207.65,118.74 217.17,118.74 218.44,120.02 219.08,120.02 D7.3
N$32
  Top 0.61: D8.3 219.39,110.17 219.39,115.25 222.57,118.43 D7.1
N$33
  Top 0.61: D1.3 125.09,120.33 118.11,120.33 R5.1
N$34
  Top 0.61: R6.2 11.43,57.79 LED1.C
N$35
  Top 0.61: R7.2 118.11,83.82 118.11,78.1 LED4.C
N$36
  Top 0.61: R8.2 78.74,83.82 78.74,78.1 LED3.C
N$37
  Top 0.61: R9.2 39.05,83.82 39.05,78.1 LED2.C

### Text on the board
tPlace: OMSI Brain Connections / Main Board / Daniel Smolentsev / DGTL / 4/23/2020
tNames: +5V | CONN / OUT | GND | +5V | NODE / OUT | GND | +5V | WORD / OUT | GND | +5V | ORPHAN / OUT | GND | GND | GND | GND | GND | GND | GND | GND | OPTO1 / IN | OPTO2 / IN | OPTO3 / IN | OPTO4 / IN | OPTO5 / IN | OPTO6 / IN | OPTO7 / IN | INPUT 7 / STATUS | INPUT 1 / STATUS | INPUT 2 / STATUS | INPUT 3 / STATUS | INPUT 4 / STATUS | INPUT 5 / STATUS | INPUT 6 / STATUS | ADXL / SENSOR / STATUS | ADXL 343 | GND | NC | SCL | SDA | 5 V #1 / Status | 5 V #2 / Status | 5 V #3 / Status | +5V | 640 | AUDIO TRIGGER 5 | AUDIO TRIGGER 4 | 12 V / Status | AUDIO TRIGGER 3 | AUDIO TRIGGER 2 | AUDIO TRIGGER 1 | +12V | +12V | GND | GND | NIB-100 DC-DC / 5V 11A regulator | 32U4MEGA / ITSYBITSY | NIB-100 DC-DC / 5V 11A regulator | NIB-100 DC-DC / 5V 11A regulator | WAVE / TRIGGER / OUT | GND | POWER IN